# Altium schematic sheet MCU_Board.SchDoc
size A3
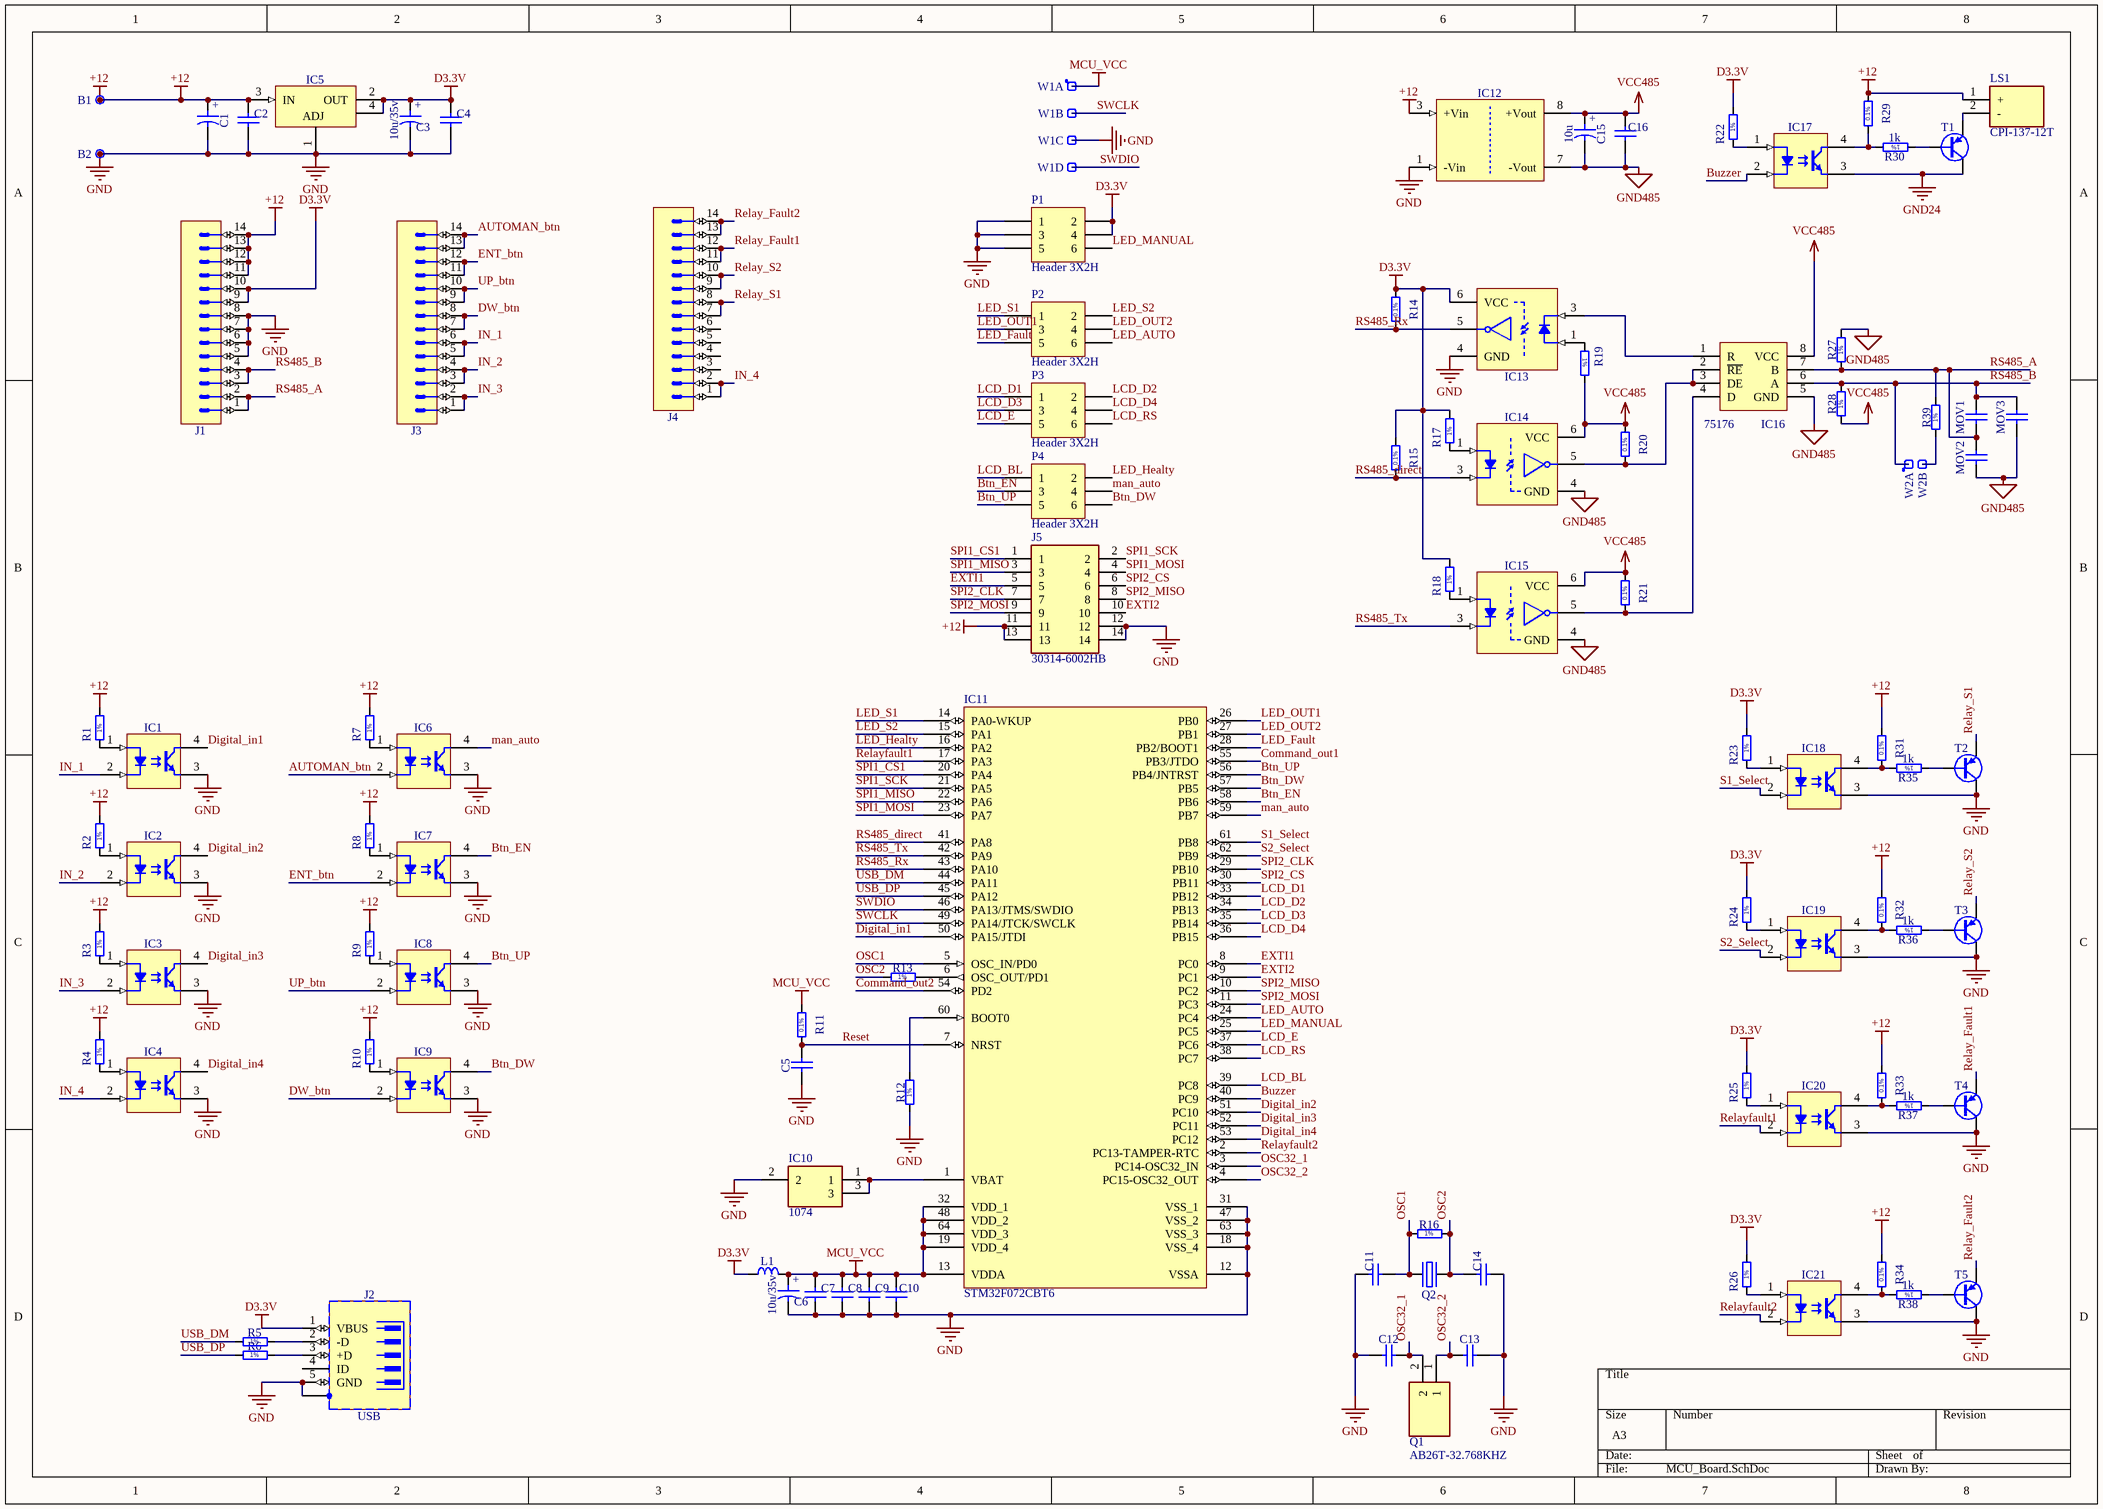
[diagram p0: MCU_Board.SchDoc]

## Parts
B1  Plated Hole  [MTG240_400]  (value not drawn)
B2  Plated Hole  [MTG240_400]  (value not drawn)
C1  100uF  [CAPAE830X1020N]  (value not drawn)
C2  0.1uf  [CAPC2012X135N]  (value not drawn)
C3  10u/35v  [CAPAE530X540N]
C4  0.1uf  [CAPC2012X135N]  (value not drawn)
C5  0.1uf  [CAPC2012X135N]  (value not drawn)
C6  10u/35v  [CAPAE530X540N]
C7  0.1uf  [CAPC2012X135N]  (value not drawn)
C8  0.1uf  [CAPC2012X135N]  (value not drawn)
C9  0.1uf  [CAPC2012X135N]  (value not drawn)
C10  0.1uf  [CAPC2012X135N]  (value not drawn)
C11  12pf  [CAPC2012X135N]  (value not drawn)
C12  12pf  [CAPC2012X135N]  (value not drawn)
C13  12pf  [CAPC2012X135N]  (value not drawn)
C14  12pf  [CAPC2012X135N]  (value not drawn)
C15  10u  [CAPAE430X540N]
C16  0.1uf  [CAPC2012X135N]  (value not drawn)
IC1  PC817  [FAIRCHILD_FOD817DSD]  (value not drawn)
IC2  PC817  [FAIRCHILD_FOD817DSD]  (value not drawn)
IC3  PC817  [FAIRCHILD_FOD817DSD]  (value not drawn)
IC4  PC817  [FAIRCHILD_FOD817DSD]  (value not drawn)
IC5  LM1117MPX-3.3  [SOT230P700X180-4N]  (value not drawn)
IC6  PC817  [FAIRCHILD_FOD817DSD]  (value not drawn)
IC7  PC817  [FAIRCHILD_FOD817DSD]  (value not drawn)
IC8  PC817  [FAIRCHILD_FOD817DSD]  (value not drawn)
IC9  PC817  [FAIRCHILD_FOD817DSD]  (value not drawn)
IC10  1074  [1074]
IC11  STM32F072CBT6  [LQFP64_N]
IC12  TES 1-0511  [DCDC_TRACO_TES1-XX1X]  (value not drawn)
IC13  ACPL-W60L-000E  [SOIC127P1150X360-6N]  (value not drawn)
IC14  ACPL-W60L-000E  [SOIC127P1150X360-6N]  (value not drawn)
IC15  ACPL-W60L-000E  [SOIC127P1150X360-6N]  (value not drawn)
IC16  75176  [SO8_N]
IC17  PC817  [FAIRCHILD_FOD817DSD]  (value not drawn)
IC18  PC817  [FAIRCHILD_FOD817DSD]  (value not drawn)
IC19  PC817  [FAIRCHILD_FOD817DSD]  (value not drawn)
IC20  PC817  [FAIRCHILD_FOD817DSD]  (value not drawn)
IC21  PC817  [FAIRCHILD_FOD817DSD]  (value not drawn)
J1  Header 14  [STELVIO-KONTEK_3910401114400]  (value not drawn)
J2  USB  [TYCO_1734035-1]
J3  Header 14  [STELVIO-KONTEK_3910401114400]  (value not drawn)
J4  Header 14  [STELVIO-KONTEK_3910401114400]  (value not drawn)
J5  30314-6002HB  [SHDR14W64P254_2X7_2540X878X955P]
L1  600  [INDC2012X105N]  (value not drawn)
LS1  CPI-137-12T  [CPI13712T]
MOV1  10nF  [CAPR500-300X720X650]  (value not drawn)
MOV2  10nF  [CAPR500-300X720X650]  (value not drawn)
MOV3  10nF  [CAPR500-300X720X650]  (value not drawn)
P1  Header 3X2H  [HDR2X3H]
P2  Header 3X2H  [HDR2X3H]
P3  Header 3X2H  [HDR2X3H]
P4  Header 3X2H  [HDR2X3H]
Q1  AB26T-32.768KHZ  [AB26T]
Q2  8.192Mhz  [XTAL1160X490X430]  (value not drawn)
R1  330  [RESC2012X60N]  (value not drawn)
R2  330  [RESC2012X60N]  (value not drawn)
R3  330  [RESC2012X60N]  (value not drawn)
R4  330  [RESC2012X60N]  (value not drawn)
R5  27  [RESC2012X60N]  (value not drawn)
R6  27  [RESC2012X60N]  (value not drawn)
R7  330  [RESC2012X60N]  (value not drawn)
R8  330  [RESC2012X60N]  (value not drawn)
R9  330  [RESC2012X60N]  (value not drawn)
R10  330  [RESC2012X60N]  (value not drawn)
R11  10k  [RESC2012X60N]  (value not drawn)
R12  510  [RESC2012X60N]  (value not drawn)
R13  220  [RESC2012X60N]  (value not drawn)
R14  10k  [RESC2012X60N]  (value not drawn)
R15  10k  [RESC2012X60N]  (value not drawn)
R16  1M  [RESC2012X60N]  (value not drawn)
R17  330  [RESC2012X60N]  (value not drawn)
R18  330  [RESC2012X60N]  (value not drawn)
R19  330  [RESC2012X60N]  (value not drawn)
R20  10k  [RESC2012X60N]  (value not drawn)
R21  10k  [RESC2012X60N]  (value not drawn)
R22  330  [RESC2012X60N]  (value not drawn)
R23  330  [RESC2012X60N]  (value not drawn)
R24  330  [RESC2012X60N]  (value not drawn)
R25  330  [RESC2012X60N]  (value not drawn)
R26  330  [RESC2012X60N]  (value not drawn)
R27  20k  [RESC2012X60N]  (value not drawn)
R28  20k  [RESC2012X60N]  (value not drawn)
R29  10k  [RESC2012X60N]  (value not drawn)
R30  1k  [RESC2012X60N]
R31  10k  [RESC2012X60N]  (value not drawn)
R32  10k  [RESC2012X60N]  (value not drawn)
R33  10k  [RESC2012X60N]  (value not drawn)
R34  10k  [RESC2012X60N]  (value not drawn)
R35  1k  [RESC2012X60N]
R36  1k  [RESC2012X60N]
R37  1k  [RESC2012X60N]
R38  1k  [RESC2012X60N]
R39  120  [RESC1608X55N]  (value not drawn)
T1  MMBT3906LT1G  [SOT95P240X110-3N]  (value not drawn)
T2  MMBT3906LT1G  [SOT95P240X110-3N]  (value not drawn)
T3  MMBT3906LT1G  [SOT95P240X110-3N]  (value not drawn)
T4  MMBT3906LT1G  [SOT95P240X110-3N]  (value not drawn)
T5  MMBT3906LT1G  [SOT95P240X110-3N]  (value not drawn)
W1  Test Point  [COMATEL_385.0358.1.04.400]  (value not drawn)  (parts A,B,C,D of 4)
W2  Test Point  [COMATEL_386.0358.1.02.440]  (value not drawn)  (parts A,B of 2)

## Nets
+12: B1.1 C1.1 C2.1 IC5.3(IN) IC12.3(+Vin) J1.11 J1.12 J1.13 J1.14 J5.11 J5.13 LS1.1(+) R1.2 R2.2 R3.2 R4.2 R7.2 R8.2 R9.2 R10.2 R29.2 R31.2 R32.2 R33.2 R34.2
D3.3V: C3.1 C4.1 IC5.2(OUT) IC5.4(OUT) IC13.6(VCC) J1.9 J1.10 J2.1(VBUS) L1.1 P1.2 P1.4 R14.2 R15.2 R17.2 R18.2 R22.2 R23.2 R24.2 R25.2 R26.2
GND: B2.1 C1.2 C2.2 C3.2 C4.2 C5.1 C6.2 C7.2 C8.2 C9.2 C10.2 C11.1 C12.1 C13.2 C14.2 IC1.3(E) IC2.3(E) IC3.3(E) IC4.3(E) IC5.1(ADJ) IC6.3(E) IC7.3(E) IC8.3(E) IC9.3(E) IC10.2 IC11.12(VSSA) IC11.18(VSS_4) IC11.31(VSS_1) IC11.47(VSS_2) IC11.63(VSS_3) IC12.1(-Vin) IC13.4(GND) IC18.3(E) IC19.3(E) IC20.3(E) IC21.3(E) J1.5 J1.6 J1.7 J1.8 J2.5(GND) J2.6(SH) J5.12 J5.14 P1.1 P1.3 P1.5 R12.1 T2.3(C) T3.3(C) T4.3(C) T5.3(C) W1.3
GND24: IC17.3(E) T1.3(C)
GND485: C15.2 C16.2 IC12.7(-Vout) IC14.4(GND) IC15.4(GND) IC16.5(GND) MOV2.1 MOV3.1 R27.2
MCU_VCC: C6.1 C7.1 C8.1 C9.1 C10.1 IC11.13(VDDA) IC11.19(VDD_4) IC11.32(VDD_1) IC11.48(VDD_2) IC11.64(VDD_3) L1.2 R11.2 W1.1
VCC485: C15.1 C16.1 IC12.8(+Vout) IC14.6(VCC) IC15.6(VCC) IC16.8(VCC) R19.2 R20.2 R21.2 R28.1
AUTOMAN_btn: IC6.2(C) J3.13 J3.14
Btn_DW: IC9.4(C) IC11.57(PB5) P4.6
Btn_EN: IC7.4(C) IC11.58(PB6) P4.3
Btn_UP: IC8.4(C) IC11.56(PB4/JNTRST) P4.5
Buzzer: IC11.40(PC9) IC17.2(C)
Command_out1: IC11.55(PB3/JTDO)
Command_out2: IC11.54(PD2)
Digital_in1: IC1.4(C) IC11.50(PA15/JTDI)
Digital_in2: IC2.4(C) IC11.51(PC10)
Digital_in3: IC3.4(C) IC11.52(PC11)
Digital_in4: IC4.4(C) IC11.53(PC12)
DW_btn: IC9.2(C) J3.7 J3.8
ENT_btn: IC7.2(C) J3.11 J3.12
EXTI1: IC11.8(PC0) J5.5
EXTI2: IC11.9(PC1) J5.10
IN_1: IC1.2(C) J3.5 J3.6
IN_2: IC2.2(C) J3.3 J3.4
IN_3: IC3.2(C) J3.1 J3.2
IN_4: IC4.2(C) J4.1 J4.2
LCD_BL: IC11.39(PC8) P4.1
LCD_D1: IC11.33(PB12) P3.1
LCD_D2: IC11.34(PB13) P3.2
LCD_D3: IC11.35(PB14) P3.3
LCD_D4: IC11.36(PB15) P3.4
LCD_E: IC11.37(PC6) P3.5
LCD_RS: IC11.38(PC7) P3.6
LED_AUTO: IC11.24(PC4) P2.6
LED_Fault: IC11.28(PB2/BOOT1) P2.5
LED_Healty: IC11.16(PA2) P4.2
LED_MANUAL: IC11.25(PC5) P1.6
LED_OUT1: IC11.26(PB0) P2.3
LED_OUT2: IC11.27(PB1) P2.4
LED_S1: IC11.14(PA0-WKUP) P2.1
LED_S2: IC11.15(PA1) P2.2
man_auto: IC6.4(C) IC11.59(PB7) P4.4
OSC1: C11.2 IC11.5(OSC_IN/PD0) Q2.2(OSC2) R16.1
OSC2: C14.1 Q2.1(OSC1) R13.1 R16.2
OSC32_1: C12.2 IC11.3(PC14-OSC32_IN) Q1.2
OSC32_2: C13.1 IC11.4(PC15-OSC32_OUT) Q1.1
Relay_Fault1: J4.11 J4.12 T4.2(E)
Relay_Fault2: J4.13 J4.14 T5.2(E)
Relay_S1: J4.7 J4.8 T2.2(E)
Relay_S2: J4.9 J4.10 T3.2(E)
Relayfault1: IC11.17(PA3) IC20.2(C)
Relayfault2: IC11.2(PC13-TAMPER-RTC) IC21.2(C)
Reset: C5.2 IC11.7(NRST) R11.1
RS485_A: IC16.7(B) J1.1 J1.2 MOV1.1 MOV2.2 R27.1 R39.2
RS485_B: IC16.6(A) J1.3 J1.4 MOV1.2 MOV3.2 R28.2 W2.1
RS485_direct: IC11.41(PA8) IC14.3(K) R15.1
RS485_Rx: IC11.43(PA10) IC13.5(VO) R14.1
RS485_Tx: IC11.42(PA9) IC15.3(K)
S1_Select: IC11.61(PB8) IC18.2(C)
S2_Select: IC11.62(PB9) IC19.2(C)
SPI1_CS1: IC11.20(PA4) J5.1
SPI1_MISO: IC11.22(PA6) J5.3
SPI1_MOSI: IC11.23(PA7) J5.4
SPI1_SCK: IC11.21(PA5) J5.2
SPI2_CLK: IC11.29(PB10) J5.7
SPI2_CS: IC11.30(PB11) J5.6
SPI2_MISO: IC11.10(PC2) J5.8
SPI2_MOSI: IC11.11(PC3) J5.9
SWCLK: IC11.49(PA14/JTCK/SWCLK) W1.2
SWDIO: IC11.46(PA13/JTMS/SWDIO) W1.4
UP_btn: IC8.2(C) J3.9 J3.10
USB_DM: IC11.44(PA11) R5.1
USB_DP: IC11.45(PA12) R6.1
NetIC1_1: IC1.1(A) R1.1
NetIC2_1: IC2.1(A) R2.1
NetIC3_1: IC3.1(A) R3.1
NetIC4_1: IC4.1(A) R4.1
NetIC6_1: IC6.1(A) R7.1
NetIC7_1: IC7.1(A) R8.1
NetIC8_1: IC8.1(A) R9.1
NetIC9_1: IC9.1(A) R10.1
NetIC10_1: IC10.1 IC10.3 IC11.1(VBAT)
NetIC11_6: IC11.6(OSC_OUT/PD1) R13.2
NetIC11_60: IC11.60(BOOT0) R12.2
NetIC13_1: IC13.1(A) R19.1
NetIC13_3: IC13.3(K) IC16.1(R)
NetIC14_1: IC14.1(A) R17.1
NetIC14_5: IC14.5(VO) IC16.2(~{RE}) IC16.3(DE) R20.1
NetIC15_1: IC15.1(A) R18.1
NetIC15_5: IC15.5(VO) IC16.4(D) R21.1
NetIC17_1: IC17.1(A) R22.1
NetIC17_4: IC17.4(C) R29.1 R30.2
NetIC18_1: IC18.1(A) R23.1
NetIC18_4: IC18.4(C) R31.1 R35.2
NetIC19_1: IC19.1(A) R24.1
NetIC19_4: IC19.4(C) R32.1 R36.2
NetIC20_1: IC20.1(A) R25.1
NetIC20_4: IC20.4(C) R33.1 R37.2
NetIC21_1: IC21.1(A) R26.1
NetIC21_4: IC21.4(C) R34.1 R38.2
NetJ2_2: J2.2(-D) R5.2
NetJ2_3: J2.3(+D) R6.2
NetLS1_2: LS1.2(-) T1.2(E)
NetR30_1: R30.1 T1.1(B)
NetR35_1: R35.1 T2.1(B)
NetR36_1: R36.1 T3.1(B)
NetR37_1: R37.1 T4.1(B)
NetR38_1: R38.1 T5.1(B)
NetR39_1: R39.1 W2.2

Not connected (* = marked no-connect by the designer): J2 4(ID); J4 3 4 5 6

## Notes on the sheet
- (in symbol CAE430-540_10UF_16V_20%) +
- (in symbol CAE530-540_10UF_35V_20%) +
- (in symbol CAE830-1020_100UF_35V_20%) +
- (in symbol R0603_120R_1%_0.1W_100PPM) 1%
- (in symbol R0805_1K_1%_0.125W_100PPM) 1%
- (in symbol R0805_1M_1%_0.125W_100PPM) 1%
- (in symbol R0805_10K_0.1%_0.1W_10PPM) 0.1%
- (in symbol R0805_20K_1%_0.125W_100PPM) 1%
- (in symbol R0805_27R_1%_0.125W_100PPM) 1%
- (in symbol R0805_220R_1%_0.125W_100PPM) 1%
- (in symbol R0805_330R_1%_0.125W_100PPM) 1%
- (in symbol R0805_510R_1%_0.125W_100PPM) 1%

## Library data of the parts
B1 B2 = PLATED_HOLE2.4_PAD4.0: Single Terminal Socket; Part Description: Plated Through Hole: Hole Dia.=2.4mm Pad Dia.=4.0mm; Mounted: No; Table: Pads; Part Number: PLATED_HOLE2.4_PAD4.0; Component Kind: Standard (No BOM); Component Type: Standard (No BOM); Pin Count: 1; Family: Plated Hole; Socket: No; SMD: No; Status: None; ComponentHeight: 0mm; Author: CERN DEM JMW; CreateDate: 10/10/2554; LatestRevisionDate: 10/10/2554; PackageDescription: Plated Through Hole: Hole Dia.=2.4mm Pad Dia.=4.0mm
C1 = CAE830-1020_100UF_35V_20%: Polarised capacitor; Part Description: Aluminum Electrolytic SMT Capacitor; Manufacturer: GENERIC; Manufacturer1 Part Number: EEEFK1V101AP; Voltage: 35V; Tolerance: ±20%; Table: Capacitors SMD; Part Number: CAE830-1020_100UF_35V_20%; Component Kind: Standard; Component Type: Standard; Pin Count: 2; Value: 100uF; Status: Not Recommended; Manufacturer Part Number: CAE830-1020_100UF_35V_20%; Case: F; Mounted: Yes; Socket: No; SMD: Yes; Manufacturer1 Example: PANASONIC; Manufacturer1 ComponentHeight: 10.2mm; HelpURL: \\cern.ch\dfs\Applications\Altium\Datasheets\CAE_PANASONIC_FK.pdf; Author: CERN DEM JLC; CreateDate: 3/12/2550; LatestRevisionDate: 3/12/2550
C2 C4 C5 C7-C10 C16 = CC0805_100NF_50V_10%_X7R: 0092-0004-8; Part Description: SMD Multilayer Chip Ceramic Capacitor; Manufacturer: GENERIC; Manufacturer1 Part Number: B37941K5104K62; Value: 100nF; Voltage: 50V; TC: X7R; Tolerance: ±10%; Table: Capacitors SMD; Part Number: CC0805_100NF_50V_10%_X7R; Component Kind: Standard; Component Type: Standard; Pin Count: 2; Status: Preferred; Manufacturer Part Number: CC0805_100NF_50V_10%_X7R; Case: 0805; Mounted: Yes; Socket: No; SMD: Yes; Manufacturer1 Example: EPCOS; Manufacturer1 ComponentHeight: 1.35mm; HelpURL: \\cern.ch\dfs\Applications\Altium\Datasheets\CC0805_X7R_EPCOS.pdf; Author: CERN DEM JLC; CreateDate: 3/12/2550; LatestRevisionDate: 3/12/2550
C3 C6 = CAE530-540_10UF_35V_20%: 0289-0032-3; Part Description: Aluminum Electrolytic SMT Capacitor; Manufacturer: GENERIC; Manufacturer1 Part Number: EEEFK1V100AR; Value: 10uF; Voltage: 35V; Tolerance: ±20%; Table: Capacitors SMD; Part Number: CAE530-540_10UF_35V_20%; Component Kind: Standard; Component Type: Standard; Pin Count: 2; Status: Not Recommended; Manufacturer Part Number: CAE530-540_10UF_35V_20%; Case: C; Mounted: Yes; Socket: No; SMD: Yes; Manufacturer1 Example: PANASONIC; Manufacturer1 ComponentHeight: 5.8mm; HelpURL: \\cern.ch\dfs\Applications\Altium\Datasheets\CAE_PANASONIC_FK.pdf; Author: CERN DEM JLC; CreateDate: 3/12/2550; LatestRevisionDate: 3/12/2550
C11 C14 = CC0805_100NF_50V_10%_X7R: 0306-0172-8; Part Description: SMD Multilayer Chip Ceramic Capacitor; Manufacturer: GENERIC; Manufacturer1 Part Number: B37941K5104K62; Value: 100nF; Voltage: 50V; TC: X7R; Tolerance: ±10%; Table: Capacitors SMD; Part Number: CC0805_100NF_50V_10%_X7R; Component Kind: Standard; Component Type: Standard; Pin Count: 2; Status: Preferred; Manufacturer Part Number: CC0805_100NF_50V_10%_X7R; Case: 0805; Mounted: Yes; Socket: No; SMD: Yes; Manufacturer1 Example: EPCOS; Manufacturer1 ComponentHeight: 1.35mm; HelpURL: \\cern.ch\dfs\Applications\Altium\Datasheets\CC0805_X7R_EPCOS.pdf; Author: CERN DEM JLC; CreateDate: 3/12/2550; LatestRevisionDate: 3/12/2550
C12 C13 = CC0805_12PF_50V_5%_NP0: 0306-0172-8; Part Description: SMD Multilayer Chip Ceramic Capacitor; Manufacturer: GENERIC; Manufacturer1 Part Number: 223886115129; Voltage: 50V; TC: NP0; Tolerance: ±5%; Table: Capacitors SMD; Part Number: CC0805_12PF_50V_5%_NP0; Component Kind: Standard; Component Type: Standard; Pin Count: 2; Value: 12pF; Status: Preferred; Manufacturer Part Number: CC0805_12PF_50V_5%_NP0; Case: 0805; Mounted: Yes; Socket: No; SMD: Yes; Manufacturer1 Example: PHYCOMP; Manufacturer1 ComponentHeight: 1.35mm; HelpURL: \\cern.ch\dfs\Applications\Altium\Datasheets\CC0805_NP0_PHYCOMP.pdf; Author: CERN DEM JLC; CreateDate: 3/12/2550; LatestRevisionDate: 3/12/2550
C15 = CAE430-540_10UF_16V_20%: 0289-0167-5; Part Description: Aluminum Electrolytic SMT Capacitor; Manufacturer: GENERIC; Manufacturer1 Part Number: EEEFK1C100AR; Value: 10uF; Voltage: 16V; Tolerance: ±20%; Table: Capacitors SMD; Part Number: CAE430-540_10UF_16V_20%; Component Kind: Standard; Component Type: Standard; Pin Count: 2; Status: Not Recommended; Manufacturer Part Number: CAE430-540_10UF_16V_20%; Case: B; Mounted: Yes; Socket: No; SMD: Yes; Manufacturer1 Example: PANASONIC; Manufacturer1 ComponentHeight: 5.8mm; HelpURL: \\cern.ch\dfs\Applications\Altium\Datasheets\CAE_PANASONIC_FK.pdf; Author: CERN DEM JLC; CreateDate: 3/12/2550; LatestRevisionDate: 3/12/2550
IC1-IC4 IC6-IC9 IC17-IC21 = FOD817DSD: 0084-0033-3; Part Description: 4-Pin High Operating Temperature Phototransistor Optocoupler; Manufacturer: FAIRCHILD SEMICONDUCTOR; Table: Optocouplers; Part Number: FOD817DSD; Component Kind: Standard; Component Type: Standard; Device: FOD817DSD; PackageDescription: SOIC, 2.54mm Pitch, 4 Pin, Body 6.5mm W X 4.6mm L X 4.6mm H; Manufacturer Part Number: FOD817DSD; Pin Count: 4; Case: SOIC4; Mounted: Yes; Socket: No; SMD: Yes; ComponentHeight: 4.6mm; HelpURL: \\cern.ch\dfs\Applications\Altium\Datasheets\FOD817DSD.pdf; Author: CERN DEM JLC; CreateDate: 21/7/2557; LatestRevisionDate: 21/7/2557
IC5 = LM1117MPX-ADJ/NOPB: 0083-0491-4; Part Description: 1.25V to 13.8V, 800mA, Adjustable Low-Dropout Linear Regulator; Manufacturer: NATIONAL SEMICONDUCTOR; Table: Regulators; Part Number: LM1117MPX-ADJ/NOPB; Component Kind: Standard; Component Type: Standard; Device: LM1117MPX-ADJ/NOPB; PackageDescription: SOT223, 2.30mm pitch; 3 pin, 3.70mm W X 6.70mm L, IPC Medium Density; Manufacturer Part Number: LM1117MPX-ADJ/NOPB; Pin Count: 4; Case: SOT223; Mounted: Yes; Socket: No; SMD: Yes; ComponentHeight: 1.8mm; HelpURL: \\cern.ch\dfs\Applications\Altium\Datasheets\LM1117MPX-ADJ-NOPB.pdf; Author: CERN DEM JLC; CreateDate: 5/7/2553; LatestRevisionDate: 5/7/2553
IC10 = 1074: Undefined or Miscellaneous; Manufacturer_Name: Keystone Electronics; Datasheet Link: https://componentsearchengine.com//1074.pdf; Height: 18.3mm; Mouser2 Part Number: 534-1074; Mouser2 Price/Stock: https://www.mouser.com/Search/Refine.aspx?Keyword=534-1074; Manufacturer_Part_Number: 1074
IC11 = STM32F103R8T6: STM32 ARM-based 32-bit MCU with 64 Kbytes Flash, 64-pin LQFP, Industrial Temperature; Published: 30-May-2008; DatasheetVersion: rev6, Mar-2008; PackageVersion: Mar-2008; PackageReference: LQFP64; Publisher: Altium Limited; PackageDescription: 64-Pin Low-Profile Quad Flat Pack, 10 x 10 mm Body, 0.5 mm Pitch (LQFP64); ComponentLink1Description: Manufacturer Link; ComponentLink1URL: www.st.com/stm32; ComponentLink2Description: Datasheet; ComponentLink2URL: http://www.st.com/stonline/products/literature/ds/13587.pdf
IC12 = TES 1-0511: 0658-0041-5 DC-DC Converter 3.3VDC/30mA-303mA,1W, / Isolated and Unregulated Single Output, / Fixed Input Voltage 12VDC; Part Description: 5V ±10% to 5V, Iout (max) 200mA, 1W DC-DC Converter; Manufacturer: TRACO POWER; Table: DC-DC Converters; Part Number: TES 1-0511; Component Kind: Standard; Component Type: Standard; Device: TES 1-0511; PackageDescription: TES 1 Series, Single Output DC/DC Converter,  Body 13.7x8mm; Manufacturer Part Number: TES 1-0511; Pin Count: 5; Mounted: Yes; Socket: No; SMD: Yes; ComponentHeight: 7.25mm; HelpURL: \\cern.ch\dfs\Applications\Altium\Datasheets\TES 1-0511.pdf; Author: CERN DEM JMW; CreateDate: 13/1/2554; LatestRevisionDate: 13/1/2554
IC13-IC15 = ACPL-W60L-000E: 0087-0267-8; Part Description: High Speed LVTTL Compatible 3.3Volt/5Volt Optocoupler; Manufacturer: AVAGO TECHNOLOGIES; Table: Optocouplers; Part Number: ACPL-W60L-000E; Component Kind: Standard; Component Type: Standard; Device: ACPL-W60L-000E; PackageDescription: SOIC, 1.27mm Pitch; 6 Pin, 6.90mm W X 4.70mm L X 3.60mm H Body, IPC Medium Density; Manufacturer Part Number: ACPL-W60L-000E; Pin Count: 6; Case: SOIC6; Mounted: Yes; Socket: No; SMD: Yes; ComponentHeight: 3.6mm; HelpURL: \\cern.ch\dfs\Applications\Altium\Datasheets\ACPL-W60L-000E.pdf; Author: CERN DEM JMW; CreateDate: 26/2/2557; LatestRevisionDate: 26/2/2557
IC16 = SN75176
J1 J3 J4 = STELVIO-KONTEK_3910401114400: Connector 14 Male; Part Description: 14 Contacts - Pitch 2.54mm - Dual Row Right Angle Strip Header - Insulator 1.7mm; Table: STELVIO-KONTEK COMATEL; Part Number: STELVIO-KONTEK_3910401114400; Component Kind: Standard; Component Type: Standard; Pin Count: 14; Family: Header 14; Mounted: Yes; Socket: No; SMD: No; Status: None; Manufacturer: STELVIO-KONTEK; Manufacturer Part Number: 3910401114400; ComponentHeight: 5.7mm; HelpURL: \\cern.ch\dfs\Applications\Altium\Datasheets\STELVIO-KONTEK_3910401114400.pdf; Author: CERN DEM JLC; CreateDate: 29/8/2556; LatestRevisionDate: 29/8/2556
J2 = TYCO_1734035-1: 5 Pin + 1 Shield USB Receptacle; Part Description: 5 Position, Right Angle, SMD Mini USB Type B Receptacle; Manufacturer: TYCO ELECTRONICS; Table: TYCO; Part Number: TYCO_1734035-1; Component Kind: Standard; Component Type: Standard; Pin Count: 6; Family: USB; Mounted: Yes; Socket: No; SMD: Yes; Status: None; Manufacturer Part Number: 1734035-1; ComponentHeight: 3.95mm; HelpURL: \\cern.ch\dfs\Applications\Altium\Datasheets\TYCO_1734035-1.pdf; Author: CERN DEM JLC; CreateDate: 2/5/2554; LatestRevisionDate: 2/5/2554
J5 = 30314-6002HB: Connector; Manufacturer_Name: 3M; Datasheet Link: https://componentsearchengine.com/Datasheets/2/30314-6002HB.pdf; Height: 9.554mm; Manufacturer_Part_Number: 30314-6002HB
L1 = IND0805_MURATA_BLM21PG221SN1D: 0169-0010-4; Part Description: SMD EMIFIL Suppression Chip Ferrite Bead; Manufacturer: MURATA; Value: 220R@100MHz; Power: 2A; Resistance: 0.05R; Tolerance: ±25%; Table: Inductors SMD; Part Number: IND0805_MURATA_BLM21PG221SN1D; Component Kind: Standard; Component Type: Standard; Pin Count: 2; Status: None; Manufacturer Part Number: BLM21PG221SN1D; Case: 0805; Mounted: Yes; Socket: No; SMD: Yes; ComponentHeight: 1.05mm; HelpURL: \\cern.ch\dfs\Applications\Altium\Datasheets\IND0402_MURATA_BLM21P.pdf; Author: CERN DEM JLC; CreateDate: 25/1/2553; LatestRevisionDate: 25/1/2553
LS1 = CPI-137-12T: Loudspeaker or Buzzer; Manufacturer_Name: CUI Devices; Datasheet Link: https://componentsearchengine.com/Datasheets/1/CPI-137-12T.pdf; Height: 8mm; Manufacturer_Part_Number: CPI-137-12T
MOV1-MOV3 = CPER_10NF_400V_10%_500-300X720X650: 0221-0014-7; Part Description: Metallized Polyester Film Capacitor (MKT); Manufacturer: EPCOS; Manufacturer Part Number: B32529C6103K000; Voltage: 400VDC/200VAC; Tolerance: ±10%; Table: Capacitors THD; Part Number: CPER_10NF_400V_10%_500-300X720X650; Component Kind: Standard; Component Type: Standard; Pin Count: 2; Value: 10nF; Status: None; Case: LS5 W3 x L7.2 x H6.5; Mounted: Yes; Socket: No; SMD: No; ComponentHeight: 6.5mm; HelpURL: \\cern.ch\dfs\Applications\Altium\Datasheets\CPER_EPCOS_B32529.pdf; Author: CERN DEM JLC; CreateDate: 23/3/2552; LatestRevisionDate: 23/3/2552
P1-P4 = Header 3X2H: Header, 3-Pin, Dual row, Right Angle; LatestRevisionDate: 17-Jul-2002; LatestRevisionNote: Re-released for DXP Platform.; Publisher: Altium Limited
Q1 = AB26T-32.768KHZ: Crystal or Oscillator; Manufacturer_Name: ABRACON; Datasheet Link: https://abracon.com/Resonators/AB26T.pdf; Manufacturer_Part_Number: AB26T-32.768KHZ
Q2 = XTAL_6MHZ_RAKON_HC49/4H SMX_20/50/10/16: No E -source; Part Description: Tolerance:± 20ppm, Stability:± 50ppm, -10°C to +70°C, 16pF, Surface Mount Quartz Crystal, HC49/4HSMX Serie; Manufacturer: RAKON; Manufacturer Part Number: 6MHz HC49/4H SMX 20/50/10/16; Value: 6MHz; Table: Crystals & Oscillators; Part Number: XTAL_6MHZ_RAKON_HC49/4H SMX_20/50/10/16; Component Kind: Standard; Component Type: Standard; PackageDescription: HC49/4H SMX Case, SMD Cristal, Body 11.6x4.9mm; Pin Count: 2; Mounted: Yes; Socket: No; SMD: Yes; ComponentHeight: 4.3mm; HelpURL: \\cern.ch\dfs\Applications\Altium\Datasheets\XTAL_RAKON_HC49-4HSMX.pdf; Author: CERN DEM JMW; CreateDate: 7/10/2551; LatestRevisionDate: 3/6/2553
R1-R4 R7-R10 R17-R19 R22-R26 = R0805_330R_1%_0.125W_100PPM: 0150-3297-4; Part Description: General Purpose Thick Film Chip Resistor; Manufacturer: GENERIC; Manufacturer1 Part Number: NRC10F3300TRF; Power: 0.125W; TC: ±100ppm/°C; Tolerance: ±1%; Table: Resistors SMD; Part Number: R0805_330R_1%_0.125W_100PPM; Component Kind: Standard; Component Type: Standard; Pin Count: 2; Value: 330; Status: Preferred; Manufacturer Part Number: R0805_330R_1%_0.125W_100PPM; Case: 0805; Mounted: Yes; Socket: No; SMD: Yes; Manufacturer1 Example: NIC COMPONENT; Manufacturer1 ComponentHeight: 0.6mm; HelpURL: \\cern.ch\dfs\Applications\Altium\Datasheets\R0805_NIC_NRC.pdf; Author: CERN DEM JLC; CreateDate: 3/12/2550; LatestRevisionDate: 13/3/2551
R5 R6 = R0805_27R_1%_0.125W_100PPM: Resistor - 1%; Part Description: General Purpose Thick Film Chip Resistor; Manufacturer: GENERIC; Manufacturer1 Part Number: NRC10F27R0TRF; Power: 0.125W; TC: ±100ppm/°C; Table: Resistors SMD; Part Number: R0805_27R_1%_0.125W_100PPM; Component Kind: Standard; Component Type: Standard; Pin Count: 2; Value: 27; Status: Preferred; Tolerance: ±1%; Manufacturer Part Number: R0805_27R_1%_0.125W_100PPM; Case: 0805; Mounted: Yes; Socket: No; SMD: Yes; Manufacturer1 Example: NIC COMPONENT; Manufacturer1 ComponentHeight: 0.6mm; HelpURL: \\cern.ch\dfs\Applications\Altium\Datasheets\R0805_NIC_NRC.pdf; Author: CERN DEM JLC; CreateDate: 3/12/2550; LatestRevisionDate: 13/3/2551
R11 R14 R15 R20 R21 R29 R31-R34 = R0805_10K_0.1%_0.1W_10PPM: 0176-0426-3; Part Description: Thin Film Chip Resistor; Manufacturer: GENERIC; Manufacturer1 Part Number: RN73C2A10KBTG; Power: 0.1W; TC: ±10ppm; Tolerance: ±0.1%; Table: Resistors SMD; Part Number: R0805_10K_0.1%_0.1W_10PPM; Component Kind: Standard; Component Type: Standard; Pin Count: 2; Value: 10k; Status: Not recommended; Manufacturer Part Number: R0805_10K_0.1%_0.1W_10PPM; Case: 0805; Mounted: Yes; Socket: No; SMD: Yes; Manufacturer1 Example: TYCO HOLSWORTHY; Manufacturer1 ComponentHeight: 0.6mm; HelpURL: \\cern.ch\dfs\Applications\Altium\Datasheets\R0805_Tyco_RN73.pdf; Author: CERN DEM JLC; CreateDate: 3/12/2550; LatestRevisionDate: 13/3/2551
R12 = R0805_510R_1%_0.125W_100PPM: Resistor - 1%; Part Description: General Purpose Thick Film Chip Resistor; Manufacturer: GENERIC; Manufacturer1 Part Number: NRC10F5100TRF; Power: 0.125W; TC: ±100ppm/°C; Table: Resistors SMD; Part Number: R0805_510R_1%_0.125W_100PPM; Component Kind: Standard; Component Type: Standard; Pin Count: 2; Value: 510; Status: Preferred; Tolerance: ±1%; Manufacturer Part Number: R0805_510R_1%_0.125W_100PPM; Case: 0805; Mounted: Yes; Socket: No; SMD: Yes; Manufacturer1 Example: NIC COMPONENT; Manufacturer1 ComponentHeight: 0.6mm; HelpURL: \\cern.ch\dfs\Applications\Altium\Datasheets\R0805_NIC_NRC.pdf; Author: CERN DEM JLC; CreateDate: 3/12/2550; LatestRevisionDate: 13/3/2551
R13 = R0805_220R_1%_0.125W_100PPM: Resistor - 1%; Part Description: General Purpose Thick Film Chip Resistor; Manufacturer: GENERIC; Manufacturer1 Part Number: NRC10F2200TRF; Power: 0.125W; TC: ±100ppm/°C; Table: Resistors SMD; Part Number: R0805_220R_1%_0.125W_100PPM; Component Kind: Standard; Component Type: Standard; Pin Count: 2; Value: 220; Status: Preferred; Tolerance: ±1%; Manufacturer Part Number: R0805_220R_1%_0.125W_100PPM; Case: 0805; Mounted: Yes; Socket: No; SMD: Yes; Manufacturer1 Example: NIC COMPONENT; Manufacturer1 ComponentHeight: 0.6mm; HelpURL: \\cern.ch\dfs\Applications\Altium\Datasheets\R0805_NIC_NRC.pdf; Author: CERN DEM JLC; CreateDate: 3/12/2550; LatestRevisionDate: 13/3/2551
R16 = R0805_1M_1%_0.125W_100PPM: Resistor - 1%; Part Description: General Purpose Thick Film Chip Resistor; Manufacturer: GENERIC; Manufacturer1 Part Number: NRC10F1004TRF; Power: 0.125W; TC: ±100ppm/°C; Table: Resistors SMD; Part Number: R0805_1M_1%_0.125W_100PPM; Component Kind: Standard; Component Type: Standard; Pin Count: 2; Value: 1M; Status: Preferred; Tolerance: ±1%; Manufacturer Part Number: R0805_1M_1%_0.125W_100PPM; Case: 0805; Mounted: Yes; Socket: No; SMD: Yes; Manufacturer1 Example: NIC COMPONENT; Manufacturer1 ComponentHeight: 0.6mm; HelpURL: \\cern.ch\dfs\Applications\Altium\Datasheets\R0805_NIC_NRC.pdf; Author: CERN DEM JLC; CreateDate: 3/12/2550; LatestRevisionDate: 13/3/2551
R27 R28 = R0805_20K_1%_0.125W_100PPM: 0176-0560-6; Part Description: General Purpose Thick Film Chip Resistor; Manufacturer: GENERIC; Manufacturer1 Part Number: NRC10F2002TRF; Power: 0.125W; TC: ±100ppm/°C; Tolerance: ±1%; Table: Resistors SMD; Part Number: R0805_20K_1%_0.125W_100PPM; Component Kind: Standard; Component Type: Standard; Pin Count: 2; Value: 20k; Status: Preferred; Manufacturer Part Number: R0805_20K_1%_0.125W_100PPM; Case: 0805; Mounted: Yes; Socket: No; SMD: Yes; Manufacturer1 Example: NIC COMPONENT; Manufacturer1 ComponentHeight: 0.6mm; HelpURL: \\cern.ch\dfs\Applications\Altium\Datasheets\R0805_NIC_NRC.pdf; Author: CERN DEM JLC; CreateDate: 3/12/2550; LatestRevisionDate: 13/3/2551
R30 R35-R38 = R0805_1K_1%_0.125W_100PPM: 0176-0313-5; Part Description: General Purpose Thick Film Chip Resistor; Manufacturer: GENERIC; Manufacturer1 Part Number: NRC10F1001TRF; Power: 0.125W; TC: ±100ppm/°C; Tolerance: ±1%; Table: Resistors SMD; Part Number: R0805_1K_1%_0.125W_100PPM; Component Kind: Standard; Component Type: Standard; Pin Count: 2; Value: 1k; Status: Preferred; Manufacturer Part Number: R0805_1K_1%_0.125W_100PPM; Case: 0805; Mounted: Yes; Socket: No; SMD: Yes; Manufacturer1 Example: NIC COMPONENT; Manufacturer1 ComponentHeight: 0.6mm; HelpURL: \\cern.ch\dfs\Applications\Altium\Datasheets\R0805_NIC_NRC.pdf; Author: CERN DEM JLC; CreateDate: 3/12/2550; LatestRevisionDate: 13/3/2551
R39 = R0603_120R_1%_0.1W_100PPM: 0150-2451-4; Part Description: General Purpose Thick Film Chip Resistor; Manufacturer: GENERIC; Manufacturer1 Part Number: NRC06F1200TRF; Power: 0.1W; TC: ±100ppm/°C; Tolerance: ±1%; Table: Resistors SMD; Part Number: R0603_120R_1%_0.1W_100PPM; Component Kind: Standard; Component Type: Standard; Pin Count: 2; Value: 120; Status: Preferred; Manufacturer Part Number: R0603_120R_1%_0.1W_100PPM; Case: 0603; Mounted: Yes; Socket: No; SMD: Yes; Manufacturer1 Example: NIC COMPONENT; Manufacturer1 ComponentHeight: 0.55mm; HelpURL: \\cern.ch\dfs\Applications\Altium\Datasheets\R0603_NIC_NRC.pdf; Author: CERN DEM JLC; CreateDate: 3/12/2550; LatestRevisionDate: 13/3/2551
T1-T5 = BSR18A: 0235-0223-4; Part Number: BSR18A; Part Description: 40V 200mA PNP General-Purpose Amplifier; Manufacturer: FAIRCHILD SEMICONDUCTOR; Table: Transistors; Component Kind: Standard; Component Type: Standard; Device: BSR18A; PackageDescription: SOT23 3-Leads, Pitch 0.95mm - Body 1.4x3mm, IPC Medium Density; Manufacturer Part Number: BSR18A; Pin Count: 3; Case: SOT23-3; Mounted: Yes; Socket: No; SMD: Yes; ComponentHeight: 1.3mm; HelpURL: \\cern.ch\dfs\Applications\Altium\Datasheets\BSR18A.pdf; Author: CERN DEM JLC; CreateDate: 15/5/2551; LatestRevisionDate: 15/5/2551
W1 = COMATEL_385.0358.1.04.400: 4 Mini Wire-Wrap Contact Strip Header; Part Description: 4 Contacts Straight Strip Header Pitch 2.54mm L=6.3mm ''Mini-Wire-Wrap''; Manufacturer: KONTEK COMATEL; Table: STELVIO-KONTEK COMATEL; Part Number: COMATEL_385.0358.1.04.400; Component Kind: Standard; Component Type: Standard; Pin Count: 4; Family: Test Point; Mounted: Yes; Socket: No; SMD: No; Status: Not recommended; Manufacturer Part Number: 385.0358.1.04.400; ComponentHeight: 8mm; HelpURL: \\cern.ch\dfs\Applications\Altium\Datasheets\COMATEL_385.0358.1.04.400.pdf; Author: CERN DEM JLC; CreateDate: 30/6/2553; LatestRevisionDate: 10/10/2555
W2 = COMATEL_386.0358.1.02.440: 2 Mini Wire-Wrap Contact Strip Header; Part Description: 2 Contacts Straight Strip Header Pitch 2.54mm L=6.3mm ''Mini-Wire-Wrap''; Manufacturer: KONTEK COMATEL; Table: STELVIO-KONTEK COMATEL; Part Number: COMATEL_386.0358.1.02.440; Component Kind: Standard; Component Type: Standard; Pin Count: 2; Family: Test Point; Mounted: Yes; Socket: No; SMD: No; Status: Obsolete; Manufacturer Part Number: 386.0358.1.02.440; ComponentHeight: 8mm; HelpURL: \\cern.ch\dfs\Applications\Altium\Datasheets\COMATEL_386.0358.1.02.440.pdf; Author: CERN DEM JLC; CreateDate: 29/8/2556; LatestRevisionDate: 30/6/2553